# EAGLE design mbedquadstepperminimalNOatmega8u2 (EAGLE 5.10)
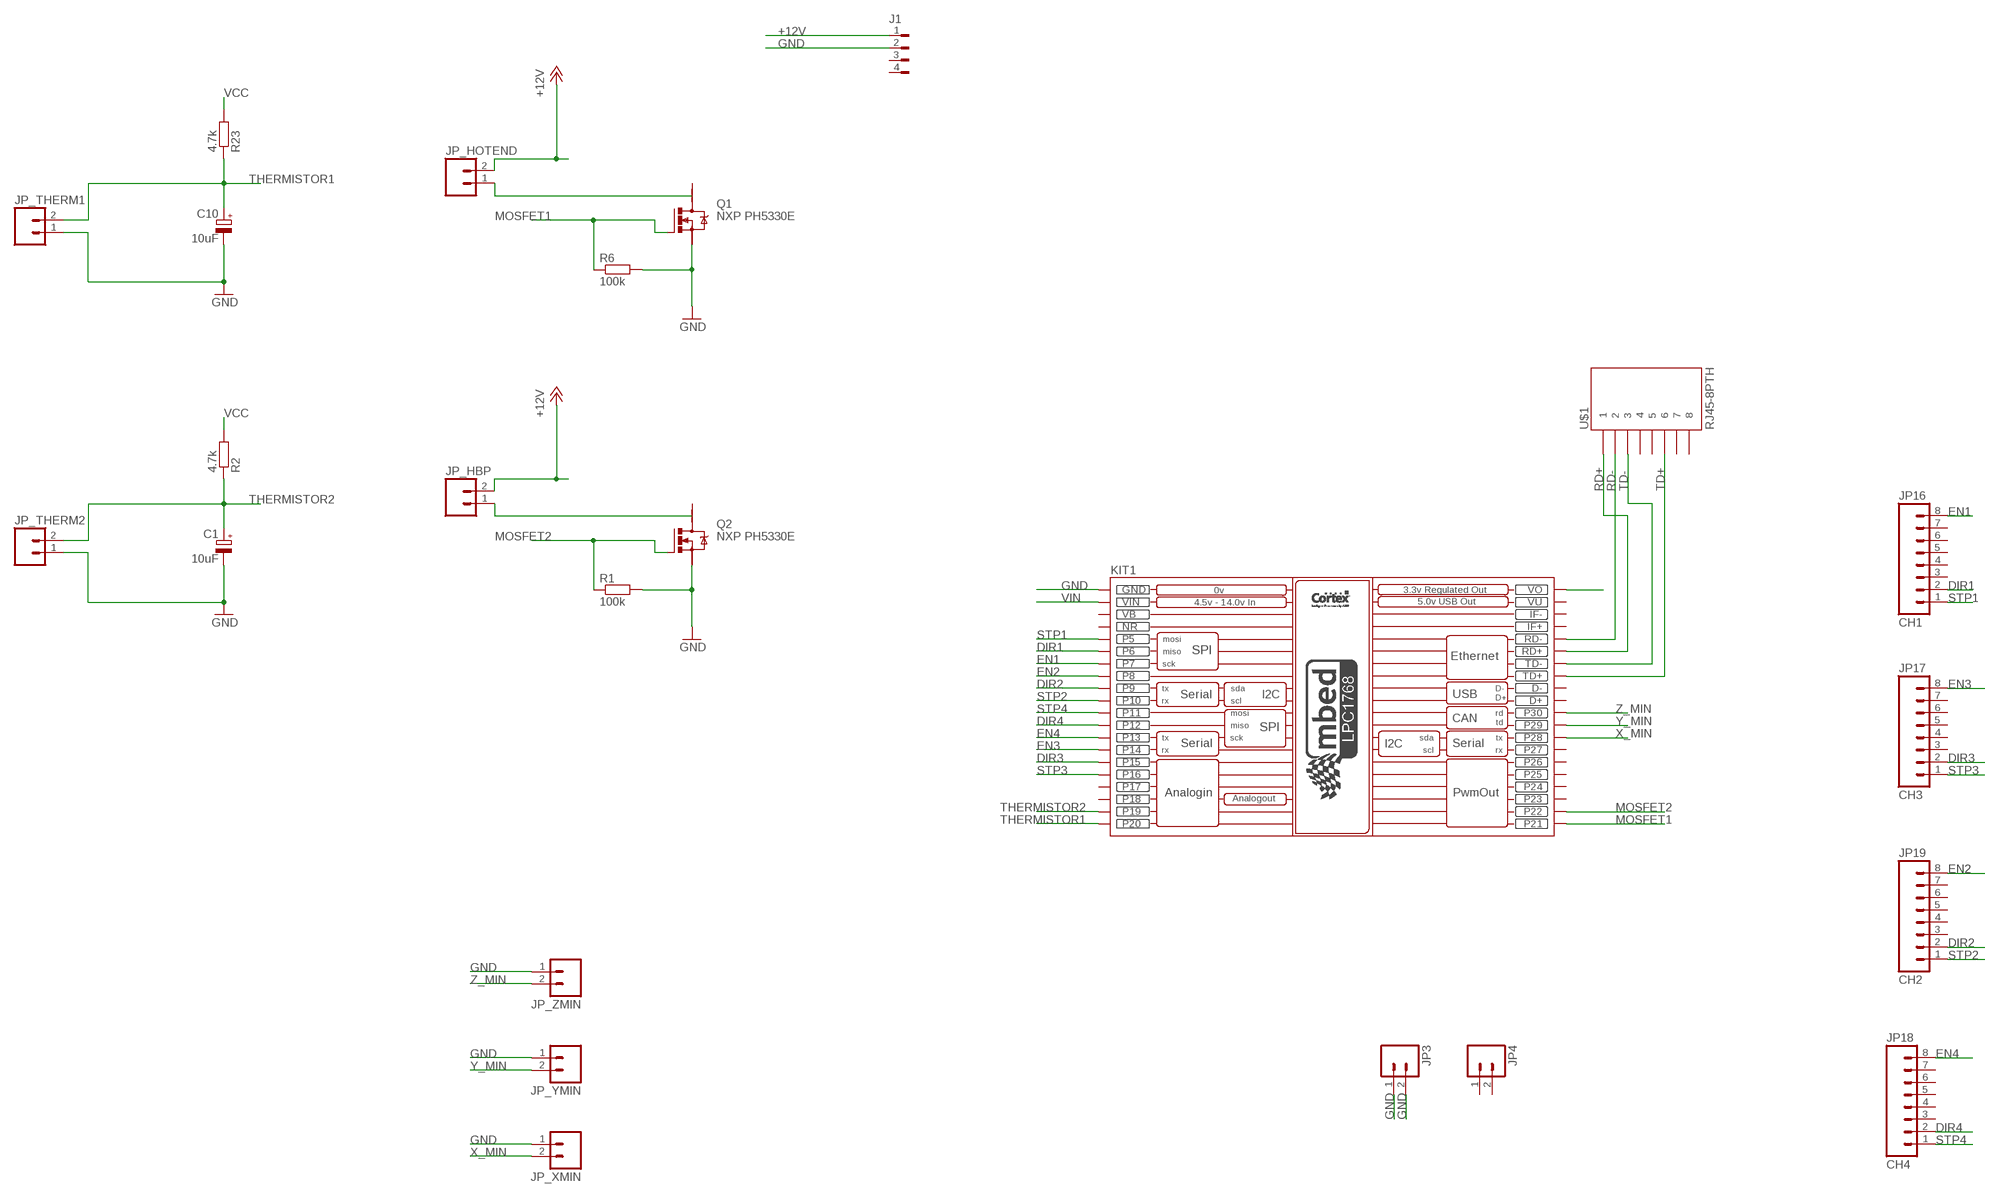
[diagram p0: schematic, sheet 1]

## Parts
C1  10uF  CPOL-EUTT5D7  [TT5D7]
C10  10uF  CPOL-EUTT5D7  [TT5D7]
J1  FLOPPY-4  [FLOPPY-4]
JP3  M02PTH  [1X02]
JP4  M02PTH  [1X02]
JP16  CH1  M08  [1X08]
JP17  CH3  M08  [1X08]
JP18  CH4  M08  [1X08]
JP19  CH2  M08  [1X08]
JP_HBP  M02LOCK_LONGPADS  [1X02_LOCK_LONGPADS]
JP_HOTEND  M02LOCK_LONGPADS  [1X02_LOCK_LONGPADS]
JP_THERM1  M02LOCK_LONGPADS  [1X02_LOCK_LONGPADS]
JP_THERM2  M02LOCK_LONGPADS  [1X02_LOCK_LONGPADS]
JP_XMIN  M02LOCK_LONGPADS  [1X02_LOCK_LONGPADS]
JP_YMIN  M02LOCK_LONGPADS  [1X02_LOCK_LONGPADS]
JP_ZMIN  M02LOCK_LONGPADS  [1X02_LOCK_LONGPADS]
KIT1  MBED_NXP_LPC1768  [MBED-KIT]
Q1  NXP PH5330E  N-MOSFET-SO8S  [SO-08]
Q2  NXP PH5330E  N-MOSFET-SO8S  [SO-08]
R1  100k  R-EU_R1206  [R1206]
R2  4.7k  R-EU_R1206  [R1206]
R6  100k  R-EU_R1206  [R1206]
R23  4.7k  R-EU_R1206  [R1206]
U$1  RJ45-8PTH  [RJ45-8]

## Nets
+12V [highpower]: J1.1 JP_HBP.2 JP_HOTEND.2
DIR1: JP16.2 KIT1.P$6(P6)
DIR2: JP19.2 KIT1.P$9(P9)
DIR3: JP17.2 KIT1.P$15(P15)
DIR4: JP18.2 KIT1.P$12(P12)
EN1: JP16.8 KIT1.P$7(P7)
EN2: JP19.8 KIT1.P$8(P8)
EN3: JP17.8 KIT1.P$14(P14)
EN4: JP18.8 KIT1.P$13(P13)
GND: C1.- C10.- J1.2 JP3.1 JP3.2 JP_THERM1.1 JP_THERM2.1 JP_XMIN.1 JP_YMIN.1 JP_ZMIN.1 KIT1.GND Q1.1(S) Q2.1(S) R1.2 R6.2
MOSFET1: KIT1.P$21(P21) Q1.4(G) R6.1
MOSFET2: KIT1.P$22(P22) Q2.4(G) R1.1
N$1: JP_HBP.1 Q2.7(D)
N$7: JP_HOTEND.1 Q1.7(D)
RD+: KIT1.RD+ U$1.1
RD-: KIT1.RD- U$1.2
STP1: JP16.1 KIT1.P$5(P5)
STP2: JP19.1 KIT1.P$10(P10)
STP3: JP17.1 KIT1.P$16(P16)
STP4: JP18.1 KIT1.P$11(P11)
TD+: KIT1.TD+ U$1.6
TD-: KIT1.TD- U$1.3
THERMISTOR1: C10.+ JP_THERM1.2 KIT1.P$20(P20) R23.1
THERMISTOR2: C1.+ JP_THERM2.2 KIT1.P$19(P19) R2.1
VCC: KIT1.VOUT(VO) R2.2 R23.2
VIN: KIT1.VIN
X_MIN: JP_XMIN.2 KIT1.P$28(P28)
Y_MIN: JP_YMIN.2 KIT1.P$29(P29)
Z_MIN: JP_ZMIN.2 KIT1.P$30(P30)
Unconnected: J1.3 J1.4 JP4.1 JP4.2 JP16.3 JP16.4 JP16.5 JP16.6 JP16.7 JP17.3 JP17.4 JP17.5 JP17.6 JP17.7 JP18.3 JP18.4 JP18.5 JP18.6 JP18.7 JP19.3 JP19.4 JP19.5 JP19.6 JP19.7 KIT1.D+ KIT1.D- KIT1.IF+ KIT1.IF- KIT1.P$17(P17) KIT1.P$18(P18) KIT1.P$23(P23) KIT1.P$24(P24) KIT1.P$25(P25) KIT1.P$26(P26) KIT1.P$27(P27) Q1.2(S) Q1.3(S) Q1.5(D) Q1.6(D) Q1.8(D) Q2.2(S) Q2.3(S) Q2.5(D) Q2.6(D) Q2.8(D) U$1.4 U$1.5 U$1.7 U$1.8

## Power pins joined to a net without a drawn wire
NR: KIT1.NR
VB: KIT1.VB
VU: KIT1.VU

## Library data of the parts
C1 C10 = rcl:CPOL-EU: POLARIZED CAPACITOR, European symbol
J1 = con-amp:FLOPPY-4: MATE N-LOCK Floppy / HDD conector Distributor: Bürklin 71F970
JP3 JP4 JP_HBP JP_HOTEND JP_THERM1 JP_THERM2 JP_XMIN JP_YMIN JP_ZMIN = SparkFun:M02: Header 2 Standard 2-pin 0.1" header. Use with straight break away headers (SKU : PRT-00116), right angle break away headers (PRT-00553), swiss pins (PRT-00743), machine pins (PRT-00117), and female headers (PRT-00115). Molex polarized connector foot print use with SKU : PRT-08233 with associated crimp pins and housings.
JP16-JP19 = SparkFun:M08: Header 8 Standard 8-pin 0.1" header. Use with straight break away headers (SKU : PRT-00116), right angle break away headers (PRT-00553), swiss pins (PRT-00743), machine pins (PRT-00117), and female headers (PRT-00115).
KIT1 = MBED_v2.1:MBED_NXP_LPC1768: Mbed LPC1768 - ARM CORTEX v2.1 * Schematic symbol is now placed in eagles's default raster. *The pads diameter are suitable for routing between mbed pins * mbed pads are 0.8 mm drill diameter. --------------------------------------------- Created by: Mohamed Yousry *Alexandria, Egypt *Email: mohamed.yousry@ieeegoldegypt.org
Q1 Q2 = transistor-power:N-MOSFET-SO8: N-Channel MOSFET Example: FDS7760A; N-Channel Logic Level PowerTrench® MOSFET FDS2572; N-Channel UltraFET® Trench MOSFET Source: www.fairchildsemi.com
R1 R2 R6 R23 = rcl:R-EU_: RESISTOR, European symbol
U$1 = SparkFun:RJ45-8: RJ45 Jack Simple RJ45, 8-pin connection - connector for common Cat5, Cat5e, and Cat6 Ethernet cables. Footprint not yet proven in production. Connector sku is PRT-00643; Breakout PCB sku is BOB-00716.

## Net classes
0 default: width 0.6 mm, drill 0.6 mm, clearance 0.1 mm
1 highpower: width 1 mm, drill 0.6 mm, clearance 0.1 mm

## Board
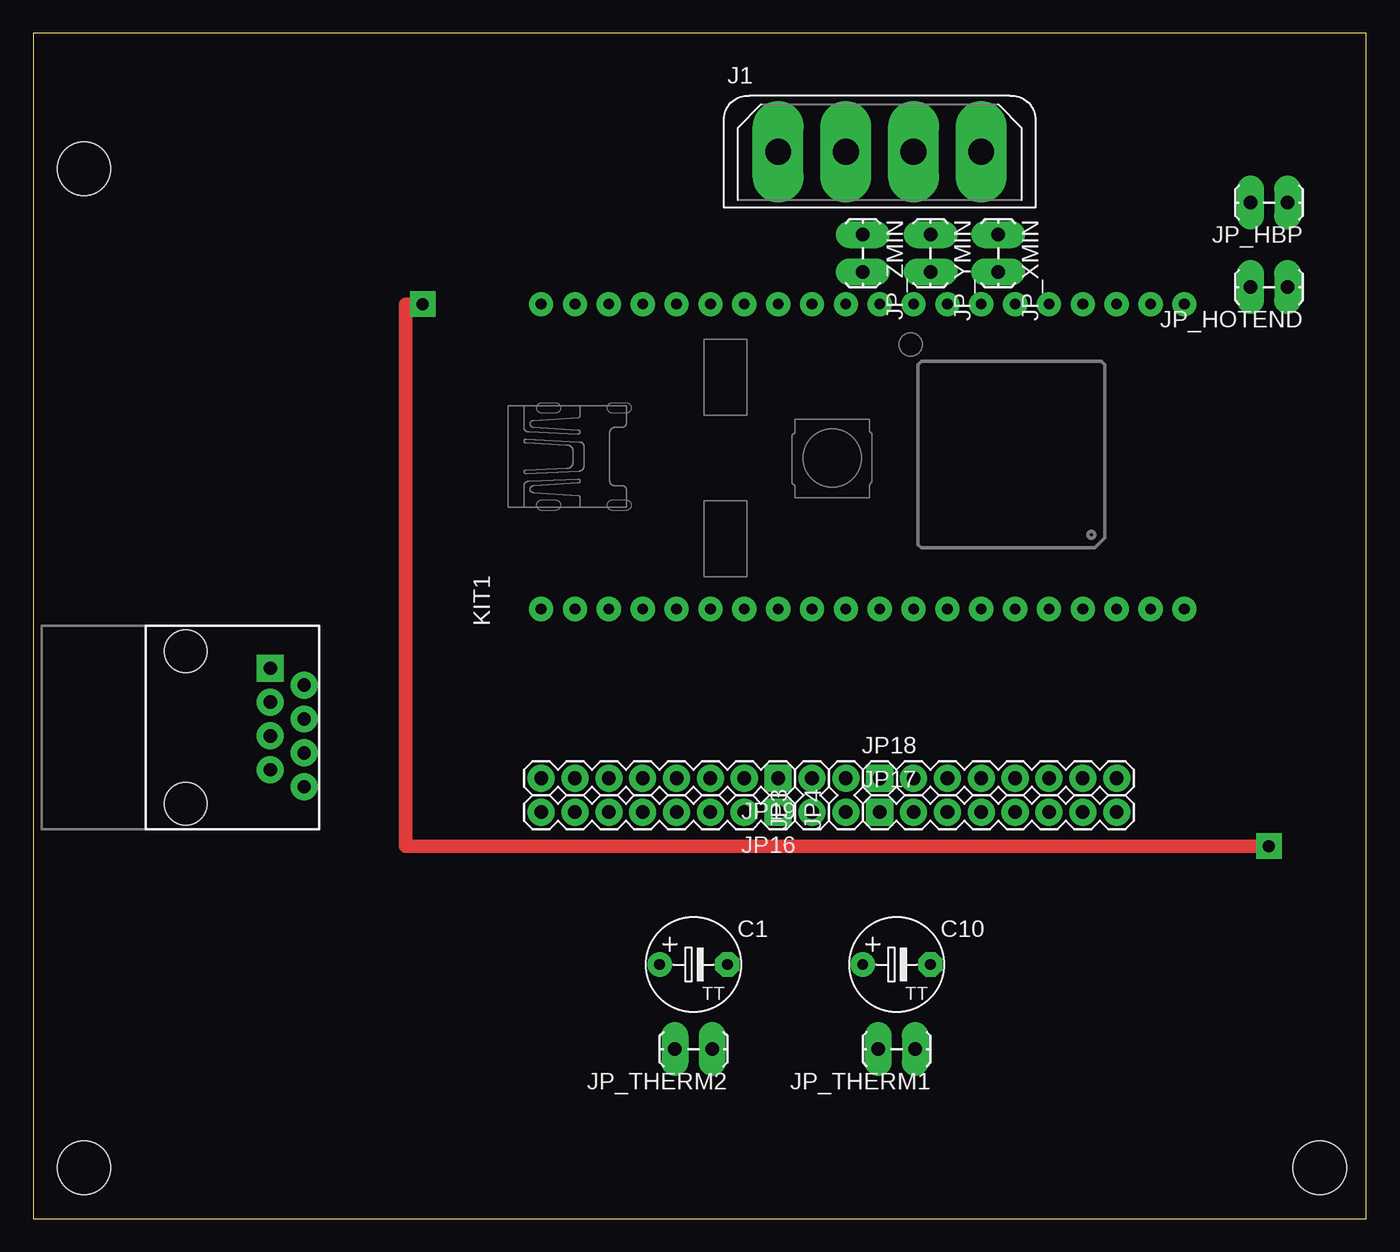
[diagram p1: board, top side]
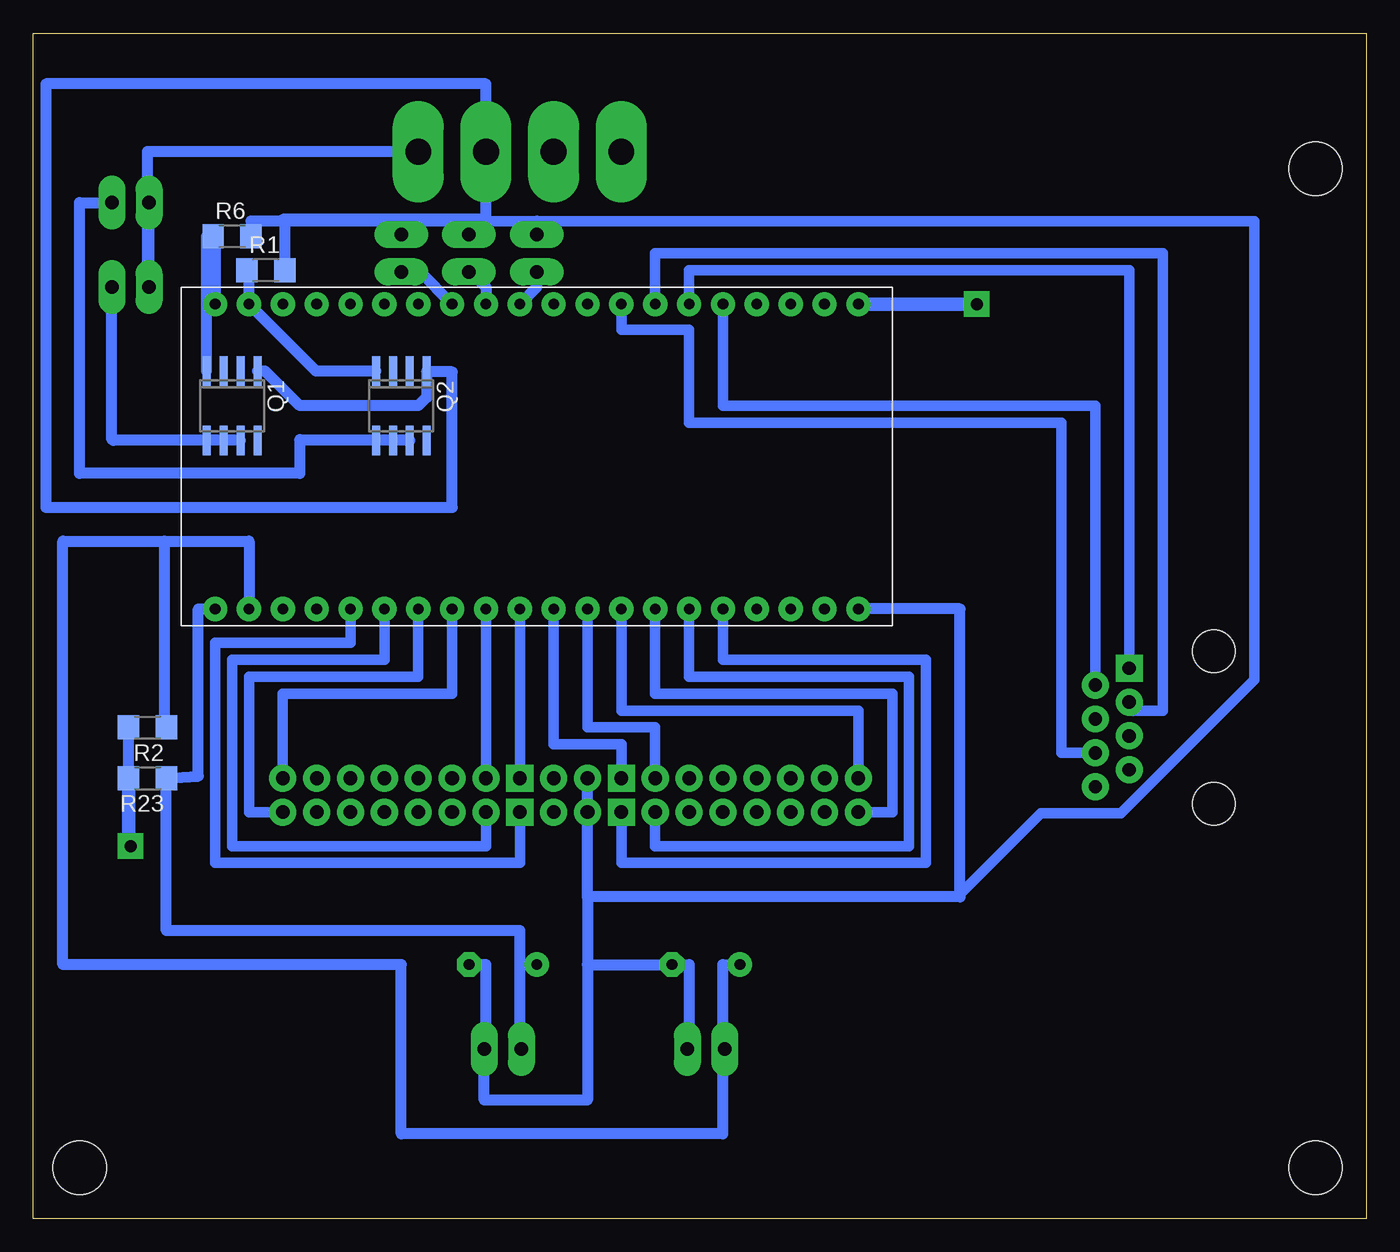
[diagram p2: board, bottom side, seen from below]

Size 100 x 88.89 mm. Coordinates in mm from the lower left corner, seen from the top.
Outline: 0,0 100,0 100,88.89 0,88.89 0,0
Copper layers (1*16): Top 0.035mm / dielectric 1.5mm / Bottom 0.035mm
Design rules "default *": minimum track width 0.8mm, minimum drill 0.8mm, track to track 8mil, track to pad 8mil, pad to pad 8mil, via to via 8mil, smd to smd 8mil, copper to edge 40mil, drill to drill 8mil, minimum pad ring 20mil, minimum via ring 20mil, stop-mask expansion 4mil, vias tented up to drill 0mil, thermal gap 10mil
Holes 4 mm at 3.81,3.81 3.81,78.74 96.52,3.81
tRestrict: area 1.3,29.2 to 21.6,44.4
vRestrict: area 36.8,44.4 to 90.2,69.8

### Footprints (pad centres in the part's own frame; a part is rotated, then mirrored left to right if it is on the bottom)
TT5D7 = drill 0.813 round: + -2.54,0 | drill 0.813 octagon: - 2.54,0
FLOPPY-4 = drill 1.93 pad 3.81 long: 1 7.62,0; 2 2.54,0; 3 -2.54,0; 4 -7.62,0
1X02 = drill 1.016 pad 1.88 round: 1 0,0; 2 2.54,0
1X08 = drill 1.016 pad 1.88 square: 1 0,0 | drill 1.016 pad 1.88 round: 2 2.54,0; 3 5.08,0; 4 7.62,0; 5 10.16,0; 6 12.7,0; 7 15.24,0; 8 17.78,0
1X02_LOCK_LONGPADS = drill 1.016 long: 1 -0.127,0; 2 2.667,0
MBED-KIT = drill 0.8 round: D+ 11.43,1.27; D- 11.43,3.81; GND -11.43,24.13; IF+ 11.43,16.51; IF- 11.43,19.05; NR -11.43,16.51; P$5 -11.43,13.97; P$6 -11.43,11.43; P$7 -11.43,8.89; P$8 -11.43,6.35; P$9 -11.43,3.81; P$10 -11.43,1.27; P$11 -11.43,-1.27; P$12 -11.43,-3.81; P$13 -11.43,-6.35; P$14 -11.43,-8.89; P$15 -11.43,-11.43; P$16 -11.43,-13.97; P$17 -11.43,-16.51; P$18 -11.43,-19.05; P$19 -11.43,-21.59; P$20 -11.43,-24.13; P$21 11.43,-24.13; P$22 11.43,-21.59; P$23 11.43,-19.05; P$24 11.43,-16.51; P$25 11.43,-13.97; P$26 11.43,-11.43; P$27 11.43,-8.89; P$28 11.43,-6.35; P$29 11.43,-3.81; P$30 11.43,-1.27; RD+ 11.43,11.43; RD- 11.43,13.97; TD+ 11.43,6.35; TD- 11.43,8.89; VB -11.43,19.05; VIN -11.43,21.59; VOUT 11.43,24.13; VU 11.43,21.59
SO-08 = smd 0.6 x 2.2: 1 -1.905,-2.6; 2 -0.635,-2.6; 3 0.635,-2.6; 4 1.905,-2.6; 5 1.905,2.6; 6 0.635,2.6; 7 -0.635,2.6; 8 -1.905,2.6
R1206 = smd 1.6 x 1.803: 1 -1.422,0; 2 1.422,0
RJ45-8 = drill 1 pad 1.88 square: 1 -4.445,6.35 | drill 1 pad 1.88 round: 2 -3.175,8.89; 3 -1.905,6.35; 4 -0.635,8.89; 5 0.635,6.35; 6 1.905,8.89; 7 3.175,6.35; 8 4.445,8.89 | hole 3.2: -5.715,0; 5.715,0

### Placement (x,y rotation side)
C1  49.53,19.05 0 top
C10  64.77,19.05 0 top
J1  63.5,80.01 0 top
JP3  58.42,30.48 90 top
JP4  60.96,30.48 90 top
JP16  55.88,30.48 180 top
JP17  63.5,30.48 0 top
JP18  63.5,33.02 0 top
JP19  55.88,33.02 180 top
JP_HBP  93.98,76.2 180 top
JP_HOTEND  93.98,69.85 180 top
JP_THERM1  66.04,12.7 180 top
JP_THERM2  50.8,12.7 180 top
JP_XMIN  72.39,73.66 270 top
JP_YMIN  67.31,73.66 270 top
JP_ZMIN  62.23,73.66 270 top
KIT1  62.23,57.15 90 top
Q1  85.09,60.96 180 bottom
Q2  72.39,60.96 180 bottom
R1  82.55,71.12 0 bottom
R2  91.44,36.83 180 bottom
R6  85.09,73.66 0 bottom
R23  91.44,33.02 180 bottom
U$1  11.43,36.83 270 top

### Tracks (layer width: path | path; a pad name or v marks a point on that pad's centre or on a via)
+12V
  Bottom 0.813: JP_HBP.2 JP_HOTEND.2 91.44,69.98 91.44,80.01 J1.1
DIR1
  Bottom 0.8: JP16.2 53.34,27.94 34.29,27.94 34.29,40.64 50.8,40.64 KIT1.P$6
DIR2
  Bottom 0.8: JP19.2 53.34,36.83 58.42,36.83 KIT1.P$9
DIR3
  Bottom 0.8: JP17.2 66.04,27.94 85.09,27.94 85.09,41.91 73.66,41.91 KIT1.P$15
DIR4
  Bottom 0.8: JP18.2 KIT1.P$12
EN1
  Bottom 0.8: JP16.8 35.56,30.48 35.56,39.37 53.34,39.37 KIT1.P$7
EN2
  Bottom 0.8: JP19.8 38.1,38.1 55.88,38.1 KIT1.P$8
EN3
  Bottom 0.8: JP17.8 83.82,30.48 83.82,40.64 71.12,40.64 KIT1.P$14
EN4
  Bottom 0.8: JP18.8 81.28,39.37 68.58,39.37 KIT1.P$13
GND
  Bottom 0.8: JP3.1 58.4,30.4 58.42,30.4 | 30.48,24.13 30.4,24.4 24.4,30.4 18.4,30.4 8.4,40.4 8.4,74.8 62.23,74.8 66,74.8 66.04,74.93
  Bottom 0.813: 58.42,24.13 58.42,19.05 | 58.42,19.05 58.42,8.89 66.17,8.89 JP_THERM1.1 66.04,12.7 66.04,19.05 C10.- | 58.42,24.13 58.42,30.4 JP3.1 JP3.2 | KIT1.GND 30.48,45.72 30.48,24.13 58.42,24.13 | JP_THERM2.1 50.8,12.7 50.8,19.05 C1.- 58.42,19.05 | 66,74.8 67.31,74.8 | 67.31,74.8 72.39,74.8 | 72.39,74.8 81.13,74.8 | 81.13,74.8 R1.2 81.13,74.78 81.28,74.93 66.04,74.93 J1.2 66.04,85.09 99.06,85.09 99.06,53.34 68.58,53.34 68.58,63.5 70.48,63.5 Q2.1 70.48,61.59 71.12,60.96 80.01,60.96 82.61,63.56 Q1.1 | 81.13,74.8 83.67,74.8 R6.2 83.82,73.81 | 62.23,74.8 JP_ZMIN.1 | 67.31,74.8 JP_YMIN.1 | 72.39,74.8 JP_XMIN.1
MOSFET1
  Bottom 0.813: KIT1.P$21 86.36,73.66 R6.1 87,73.66 Q1.4
MOSFET2
  Bottom 0.813: R1.1 83.82,71.12 KIT1.P$22 78.8,63.56 Q2.4
N$1
  Bottom 0.813: Q2.7 80.01,58.36 | 80.01,58.36 80.01,58.42 | 80.01,58.36 80.01,55.88 96.52,55.88 96.52,76.2 JP_HBP.1
N$7
  Bottom 0.813: Q1.7 93.98,58.36 93.98,58.42 94.11,58.42 JP_HOTEND.1
RD+
  Bottom 0.8: KIT1.RD+ 50.8,71.12 17.78,71.12 U$1.1
RD-
  Bottom 0.8: KIT1.RD- 48.26,60.96 20.32,60.96 U$1.2
STP1
  Bottom 0.8: JP16.1 55.88,26.67 33.02,26.67 33.02,41.91 48.26,41.91 KIT1.P$5
STP2
  Bottom 0.8: JP19.1 55.88,35.56 60.96,35.56 KIT1.P$10
STP3
  Bottom 0.8: JP17.1 63.5,26.67 86.36,26.67 86.36,43.18 76.2,43.18 KIT1.P$16
STP4
  Bottom 0.8: JP18.1 KIT1.P$11
TD+
  Bottom 0.8: U$1.6 22.86,34.92 22.86,59.69 50.8,59.69 50.8,66.67 55.88,66.67 KIT1.TD+
TD-
  Bottom 0.8: KIT1.TD- 53.34,72.39 15.24,72.39 15.24,38.1 17.78,38.1 U$1.3
THERMISTOR1
  Bottom 0.813: R23.1 87.63,33.17 87.63,45.72 KIT1.P$20 | R23.1 90.17,33.02 | JP_THERM1.2 63.5,12.7 63.5,19.05 | 63.5,19.05 C10.+ | 63.5,19.05 63.5,21.59 90.02,21.59 R23.1
THERMISTOR2
  Bottom 0.813: 48.26,12.7 48.26,19.05 C1.+ | 48.26,12.7 JP_THERM2.2 | 48.26,12.7 48.26,6.35 72.39,6.35 72.39,19.05 97.79,19.05 97.79,50.8 90.17,50.8 | 90.17,50.8 83.82,50.8 KIT1.P$19 | R2.1 90.17,36.83 90.17,50.8
VCC  (via drill 0.9)
  Top 1.016: v92.71,27.94 27.94,27.94 27.94,68.58 v29.21,68.58
  Bottom 0.813: R23.2 R2.2
  Bottom 1.016: v29.21,68.58 KIT1.VOUT | R23.2 92.86,28.09 v92.71,27.94
X_MIN
  Bottom 0.813: JP_XMIN.2 70.99,70.99 KIT1.P$28
Y_MIN
  Bottom 0.813: JP_YMIN.2 67.18,70.99 66.04,69.85 KIT1.P$29
Z_MIN
  Bottom 0.813: JP_ZMIN.2 62.23,69.85 KIT1.P$30